# Altium schematic sheet MotorControl.SchDoc
size A4; Revision: C.2(PCB.SCH)
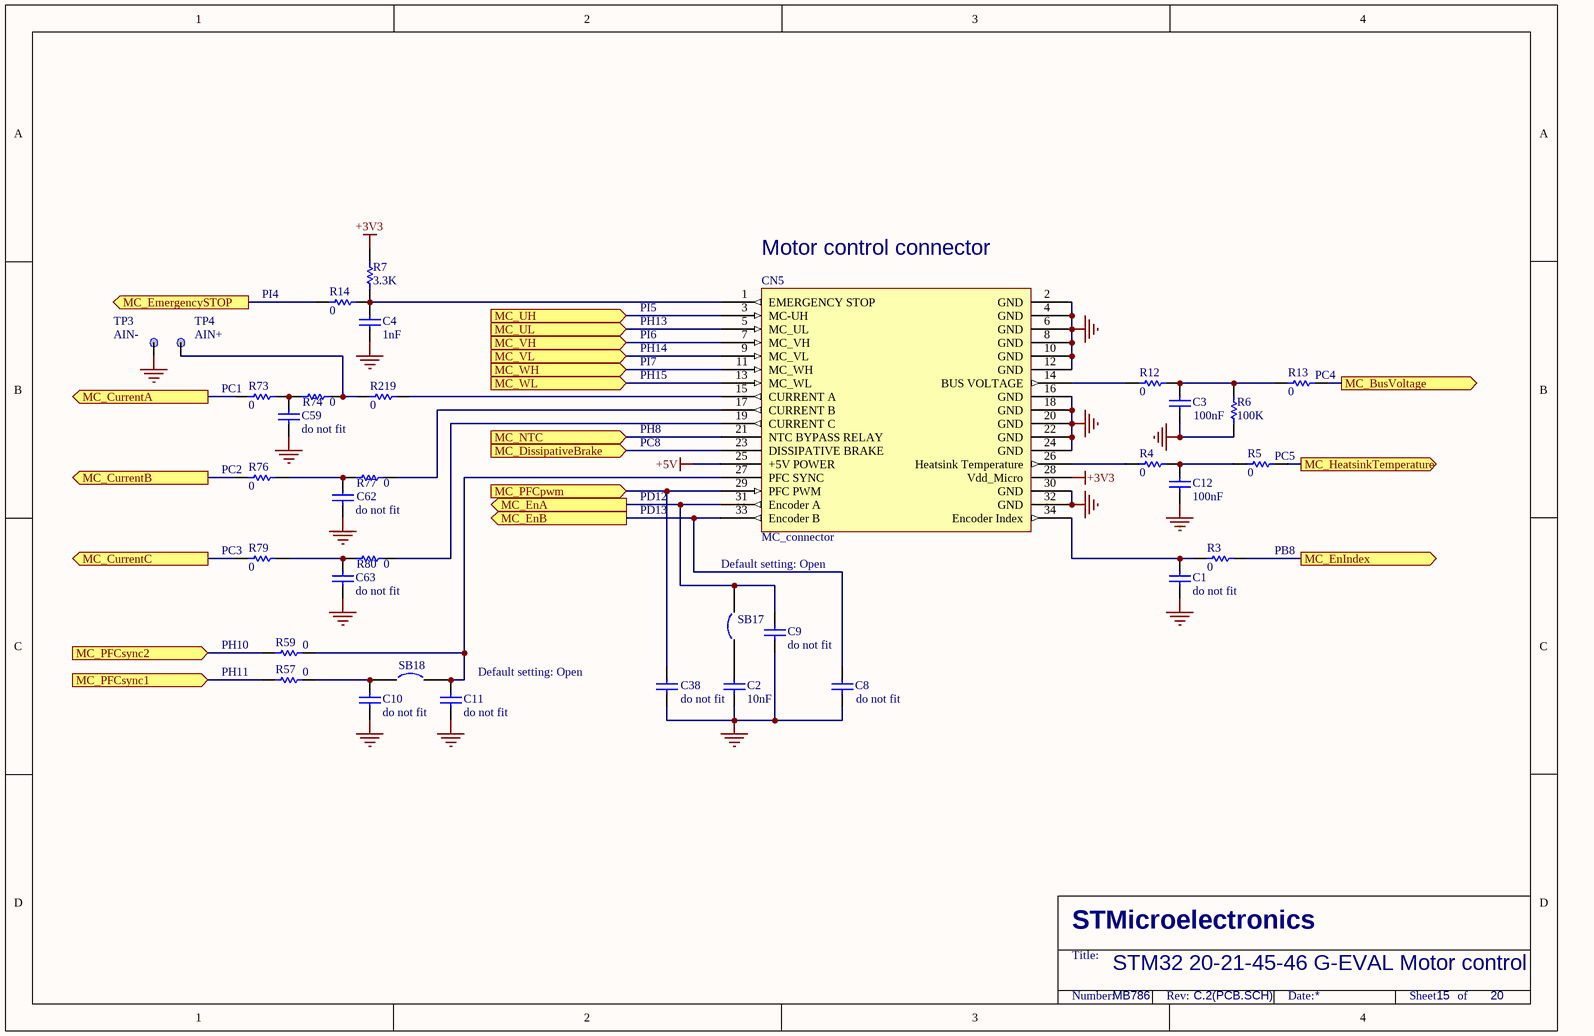
[diagram p0: MotorControl.SchDoc]

## Parts
C1  do not fit  [0603C]
C2  10nF  [0402C]
C3  100nF  [0402C]
C4  1nF  [0603C]
C8  do not fit  [0603C]
C9  do not fit  [0603C]
C10  do not fit  [0603C]
C11  do not fit  [0603C]
C12  100nF  [0402C]
C38  do not fit  [0603C]
C59  do not fit  [0603C]
C62  do not fit  [0603C]
C63  do not fit  [0603C]
CN5  MC_connector  [IDC34S]
R3  0  [0603R]
R4  0  [0603R]
R5  0  [0603R]
R6  100K  [0402R]
R7  3.3K  [0603R]
R12  0  [0603R]
R13  0  [0603R]
R14  0  [0603R]
R57  0  [0603R]
R59  0  [0603R]
R73  0  [0603R]
R74  0  [0603R]
R76  0  [0603R]
R77  0  [0603R]
R79  0  [0603R]
R80  0  [0603R]
R219  0  [0603R]
SB17  (no value)  [JP2_SMD]
SB18  (no value)  [JP2_SMD]
TP3  AIN-  [TP]
TP4  AIN+  [TP]

## Ports
MC_BusVoltage (out), MC_CurrentA (out), MC_CurrentB (out), MC_CurrentC (out), MC_DissipativeBrake (in), MC_EmergencySTOP (out), MC_EnA (out), MC_EnB (out), MC_EnIndex (out), MC_HeatsinkTemperature (out), MC_NTC (in), MC_PFCpwm (in), MC_PFCsync1 (in), MC_PFCsync2 (in), MC_UH (in), MC_UL (in), MC_VH (in), MC_VL (in), MC_WH (in), MC_WL (in)

## Nets
+3V3: CN5.28(Vdd_Micro) R7.2
+5V: CN5.25(+5V_POWER)
GND: C1.1 C2.1 C3.1 C4.1 C8.1 C9.1 C10.1 C11.1 C12.1 C38.1 C59.1 C62.1 C63.1 CN5.2(GND) CN5.4(GND) CN5.6(GND) CN5.8(GND) CN5.10(GND) CN5.12(GND) CN5.16(GND) CN5.18(GND) CN5.20(GND) CN5.22(GND) CN5.24(GND) CN5.30(GND) CN5.32(GND) R6.1 TP3.1
MC_BusVoltage: R13.2 ; port MC_BusVoltage
MC_CurrentA: R73.1 ; port MC_CurrentA
MC_CurrentB: R76.1 ; port MC_CurrentB
MC_CurrentC: R79.1 ; port MC_CurrentC
MC_DissipativeBrake: CN5.23(DISSIPATIVE_BRAKE) ; port MC_DissipativeBrake
MC_EmergencySTOP: R14.2 ; port MC_EmergencySTOP
MC_EnA: C9.2 CN5.31(Encoder_A) SB17.2 ; port MC_EnA
MC_EnB: C8.2 CN5.33(Encoder_B) ; port MC_EnB
MC_EnIndex: R3.2 ; port MC_EnIndex
MC_HeatsinkTemperature: R5.2 ; port MC_HeatsinkTemperature
MC_NTC: CN5.21(NTC_BYPASS_RELAY) ; port MC_NTC
MC_PFCpwm: C38.2 CN5.29(PFC_PWM) ; port MC_PFCpwm
MC_PFCsync1: R57.1 ; port MC_PFCsync1
MC_PFCsync2: R59.1 ; port MC_PFCsync2
MC_UH: CN5.3(MC-UH) ; port MC_UH
MC_UL: CN5.5(MC_UL) ; port MC_UL
MC_VH: CN5.7(MC_VH) ; port MC_VH
MC_VL: CN5.9(MC_VL) ; port MC_VL
MC_WH: CN5.11(MC_WH) ; port MC_WH
MC_WL: CN5.13(MC_WL) ; port MC_WL
NetC1_2: C1.2 CN5.34(Encoder_Index) R3.1
NetC2_2: C2.2 SB17.1
NetC3_2: C3.2 R6.2 R12.2 R13.1
NetC4_2: C4.2 CN5.1(EMERGENCY_STOP) R7.1 R14.1
NetC10_2: C10.2 R57.2 SB18.1
NetC11_2: C11.2 CN5.27(PFC_SYNC) R59.2 SB18.2
NetC12_2: C12.2 R4.2 R5.1
NetC59_2: C59.2 R73.2 R74.1
NetC62_2: C62.2 R76.2 R77.1
NetC63_2: C63.2 R79.2 R80.1
NetCN5_14: CN5.14(BUS_VOLTAGE) R12.1
NetCN5_15: CN5.15(CURRENT_A) R219.1
NetCN5_17: CN5.17(CURRENT_B) R77.2
NetCN5_19: CN5.19(CURRENT_C) R80.2
NetCN5_26: CN5.26(Heatsink_Temperature) R4.1
NetR74_2: R74.2 R219.2 TP4.1

## Notes on the sheet
- (near R14) PI4
- PI5
- (near CN5) Motor control connector
- PH13
- PH14
- PH15
- PI6
- PI7
- (near R13) PC4
- (near R73) PC1
- PH8
- PC8
- (near R76) PC2
- PD13
- PD12
- (near R5) PC5
- (near R79) PC3
- Default setting: Open
- (near R3) PB8
- PH10
- PH11
- (near C11) Default setting: Open
- STM32 20-21-45-46 G-EVAL Motor control
- MB786
- 15
- 20
- STMicroelectronics
- Title:
- Number:
- Rev:
- Date:
- Sheet       of

## Library data of the parts
C1-C3 C8-C12 C38 C59 C62 C63 = cap: Capacitor; Value: 100pF; Published: 8-Jun-2000; Revision: July-2002: Re-released for DXP Platform.; Publisher: Altium Limited
C4 = CAP: Capacitor; Value: 100pF; Published: 8-Jun-2000; Revision: July-2002: Re-released for DXP Platform.; Publisher: Altium Limited
R3-R7 R12-R14 R57 R59 R73 R74 R76 R77 R79 R80 R219 = Res1: Resistor; Value: 1K; Published: 8-Jun-2000; Revision: July-2002: Re-released for DXP Platform.; Publisher: Altium Limited
SB17 SB18 = Circuit Breaker: Published: 24-Mar-1999; Revision: July-2002: Re-released for DXP Platform.; Publisher: Altium Limited
TP3 TP4 = TP